# Altium project PCB_Project.PrjPcb
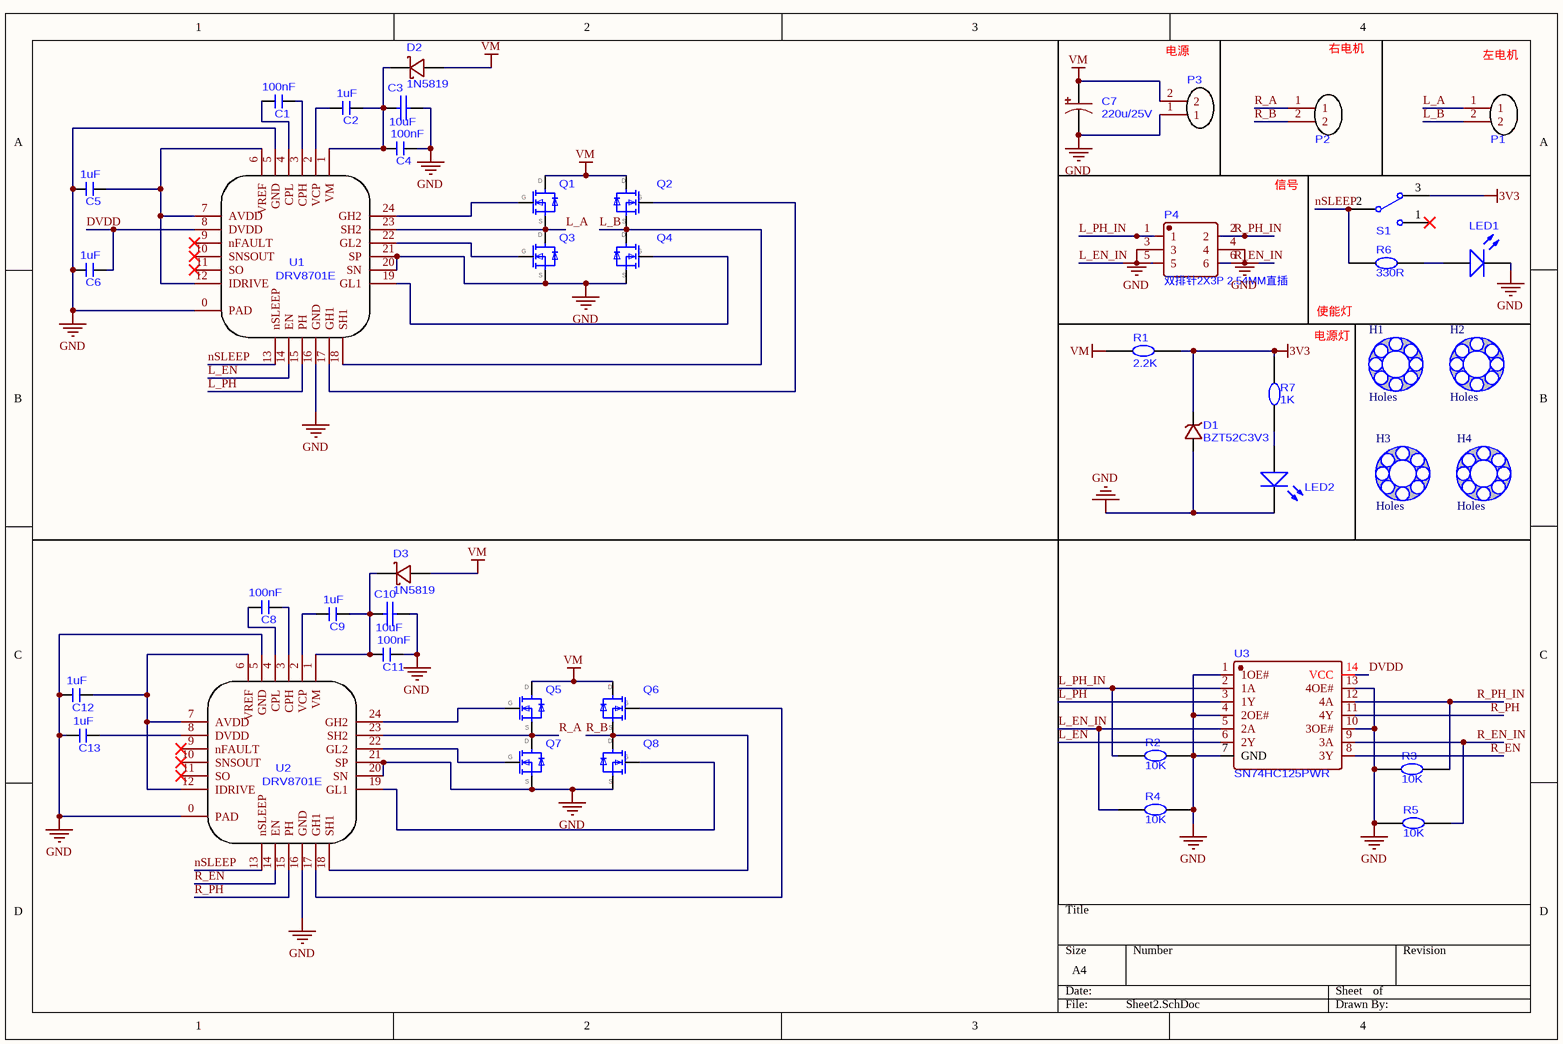
[diagram p0: Sheet2.SchDoc]
1 sheet, 45 parts. Net scope: global (net labels, ports and power ports of the same name join across sheets).
Board file: PCB2.PcbDoc

## Sheet Sheet2.SchDoc
size A4; SheetNumber: 1; SheetTotal: 1

### Parts
C1  100nF  [0603C]
C2  1uF  [0603C]
C3  10uF  [0805-C]
C4  100nF  [0603C]
C5  1uF  [0603C]
C6  1uF  [0603C]
C7  220u/25V  [220UF_25V]
C8  100nF  [0603C]
C9  1uF  [0603C]
C10  10uF  [0805-C]
C11  100nF  [0603C]
C12  1uF  [0603C]
C13  1uF  [0603C]
D1  BZT52C3V3  [SOD-123]
D2  1N5819  [1N5819]
D3  1N5819  [1N5819]
H1  Holes  [M3-星月孔]
H2  Holes  [M3-星月孔]
H3  Holes  [M3-星月孔]
H4  Holes  [M3-星月孔]
LED1  LED  [0603LED]  (value not drawn)
LED2  LED  [0603LED]  (value not drawn)
P1  5.08-2P  [2P-5.08MM]  (value not drawn)
P2  5.08-2P  [2P-5.08MM]  (value not drawn)
P3  5.08-2P  [2P-5.08MM]  (value not drawn)
P4  双排针2X3P 2.54MM直插  [2X3 2.54]
Q1  TPH1R403NL_L  [TPH1R403NL]  (value not drawn)
Q2  TPH1R403NL_L  [TPH1R403NL]  (value not drawn)
Q3  TPH1R403NL_L  [TPH1R403NL]  (value not drawn)
Q4  TPH1R403NL_L  [TPH1R403NL]  (value not drawn)
Q5  TPH1R403NL_L  [TPH1R403NL]  (value not drawn)
Q6  TPH1R403NL_L  [TPH1R403NL]  (value not drawn)
Q7  TPH1R403NL_L  [TPH1R403NL]  (value not drawn)
Q8  TPH1R403NL_L  [TPH1R403NL]  (value not drawn)
R1  2.2K  [0603R]
R2  10K  [0603R]
R3  10K  [0603R]
R4  10K  [0603R]
R5  10K  [0603R]
R6  330R  [0603R]
R7  1K  [0603R]
S1  SW1:T8013  [SW1_T8013]  (value not drawn)
U1  DRV8701E  [DRV8701E]
U2  DRV8701E  [DRV8701E]
U3  SN74HC125PWR  [TSSOP-14_L5.0-W4.4-P0.65-LS6.5-BL]

### Nets
3V3: D1.2(K) R1.2 R7.2 S1.3
GND: C3.1 C4.1 C5.2 C6.1 C7.2 C10.1 C11.1 C12.2 C13.1 D1.1(A) LED1.2(K) LED2.2(K) P3.1 P4.3 P4.4 Q3.3(S) Q4.3(S) Q7.3(S) Q8.3(S) R2.2 R3.1 R4.2 R5.1 U1.0(PAD) U1.5(GND) U1.16(GND) U1.20(SN) U1.21(SP) U2.0(PAD) U2.5(GND) U2.16(GND) U2.20(SN) U2.21(SP) U3.1(1OE#) U3.4(2OE#) U3.7(GND) U3.10(3OE#) U3.13(4OE#)
VM: C7.1 D2.2 D3.2 P3.2 Q1.1(D) Q2.1(D) Q5.1(D) Q6.1(D) R1.1
DVDD: C6.2 U1.8(DVDD) U3.14(VCC)
L_A: P1.1 Q1.3(S) Q3.1(D) U1.23(SH2)
L_B: P1.2 Q2.3(S) Q4.1(D) U1.18(SH1)
L_EN: U1.14(EN) U3.6(2Y)
L_EN_IN: P4.5 R4.1 U3.5(2A)
L_PH: U1.15(PH) U3.3(1Y)
L_PH_IN: P4.1 R2.1 U3.2(1A)
nSLEEP: R6.1 S1.2 U1.13(nSLEEP) U2.13(nSLEEP)
R_A: P2.1 Q5.3(S) Q7.1(D) U2.23(SH2)
R_B: P2.2 Q6.3(S) Q8.1(D) U2.18(SH1)
R_EN: U2.14(EN) U3.8(3Y)
R_EN_IN: P4.6 R5.2 U3.9(3A)
R_PH: U2.15(PH) U3.11(4Y)
R_PH_IN: P4.2 R3.2 U3.12(4A)
NetC1_1: C1.1 U1.4(CPL)
NetC1_2: C1.2 U1.3(CPH)
NetC2_1: C2.1 C3.2 C4.2 D2.1 U1.1(VM)
NetC2_2: C2.2 U1.2(VCP)
NetC5_1: C5.1 U1.6(VREF) U1.7(AVDD) U1.12(IDRIVE)
NetC8_1: C8.1 U2.4(CPL)
NetC8_2: C8.2 U2.3(CPH)
NetC9_1: C9.1 C10.2 C11.2 D3.1 U2.1(VM)
NetC9_2: C9.2 U2.2(VCP)
NetC12_1: C12.1 U2.6(VREF) U2.7(AVDD) U2.12(IDRIVE)
NetC13_2: C13.2 U2.8(DVDD)
NetLED1_1: LED1.1 R6.2
NetLED2_1: LED2.1 R7.1
NetQ1_2: Q1.2(G) U1.24(GH2)
NetQ2_2: Q2.2(G) U1.17(GH1)
NetQ3_2: Q3.2(G) U1.22(GL2)
NetQ4_2: Q4.2(G) U1.19(GL1)
NetQ5_2: Q5.2(G) U2.24(GH2)
NetQ6_2: Q6.2(G) U2.17(GH1)
NetQ7_2: Q7.2(G) U2.22(GL2)
NetQ8_2: Q8.2(G) U2.19(GL1)

Not connected (* = marked no-connect by the designer): S1 1*; U1 9(nFAULT)* 10(SNSOUT)* 11(SO)*; U2 9(nFAULT)* 10(SNSOUT)* 11(SO)*

### Notes on the sheet
- (near P3) 电源
- (near P2) 右电机
- (near P1) 左电机
- 信号
- 使能灯
- 电源灯

### Library data of the parts
C1 C2 C4-C6 C8 C9 C11-C13 = 0603-C
C3 C10 = 0805-C
H1-H4 = 星月孔: holes in the corner of the bord
R1-R7 = 0603-R